# EasyEDA Pro project CH32V003_Programmer.eprj

# Schematic V1Schematic
Board Name: Board1; Create Date: 2025-06-25; Page Name: P1; Project Name: CH32V003 Programmer; Schematic Name: Schematic1; Update Date: 2025-08-17; Company: m039; Drawn: Dmitry Mozgin; Page Size: A4; Version: V1.0
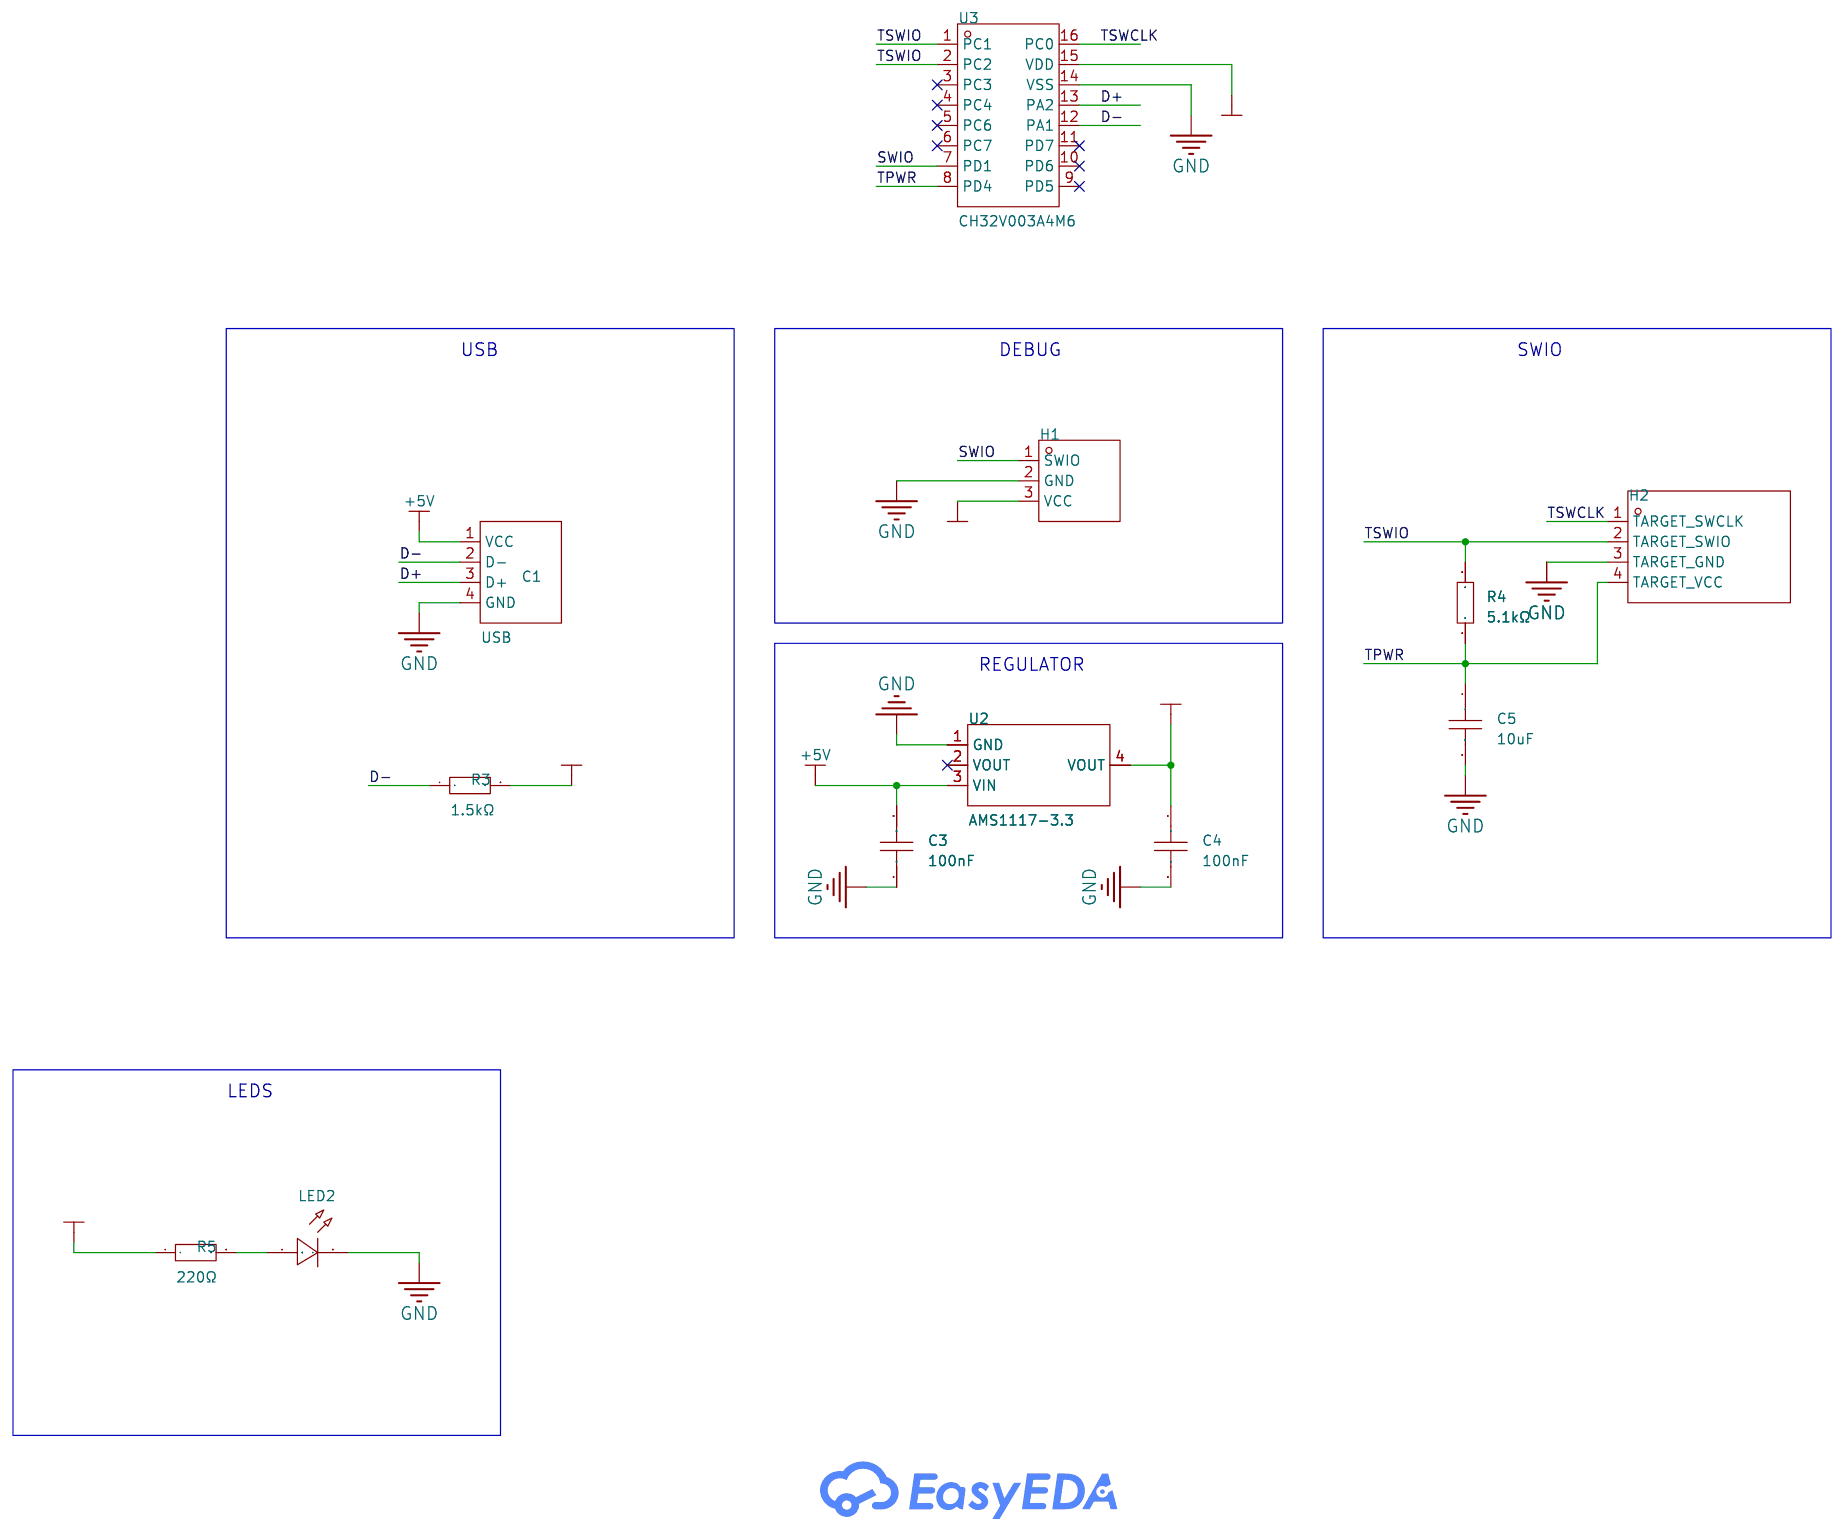
[diagram p0: schematic sheet]

## Parts
C1  USB  [USB Type-C 4P]
C3  100nF  [CAP-TH_L5.8-W3.0-P4.7-D0.45]
C4  100nF  [CAP-TH_L5.8-W3.0-P4.7-D0.45]
C5  10uF  [CAP-TH_L5.8-W3.0-P4.7-D0.45]
H1  -  [HDR-TH_3P-P2.54-V-M]
H2  -  [HDR-TH_4P-P2.54-V-M]
LED2  -  [LED-TH_BD3.0-P2.54-FD]
R3  1.5kΩ  [RES-TH_BD1.8-L3.2-P7.20-D0.4]
R4  5.1kΩ  [RES-TH_BD1.8-L3.2-P7.20-D0.4]
R5  220Ω  [RES-TH_BD1.8-L3.2-P7.20-D0.4]
U2  AMS1117-3.3  [SOT-223-3_L6.5-W3.4-P2.30-LS7.0-BR]
U3  CH32V003A4M6  [SOIC-16_L9.9-W3.9-P1.27-LS6.0-BL]

## Library data of the parts
C1 = USB Type-C 4P Board
C3-C5 = 1C10Z5U104M050B: LCSC Part Name: 100nF ±20% 50V; Supplier Part: C3009699; Manufacturer: VISHAY(威世); Supplier Footprint: 插件,P=10mm; JLCPCB Part Class: Extended Part; Datasheet: https://atta.szlcsc.com/upload/public/pdf/source/20210701/0CF1A7AD3406E72B391D35880AF61B15.pdf; Supplier: LCSC; Tolerance: ±20%; Voltage Rating: 50V; Pin Spacing: 2.54mm; Temperature Coefficient: Z5U; Diameter: 5.08mm; Body Thickness: 3.18mm
H1 = HDR-M_2.54_1x3P: Supplier Footprint: Through
H2 = HDR-M_2.54_1x4P: Supplier Footprint: Through
LED2 = LED_TH-R_3mm: Supplier Footprint: Through
R3-R5 = Res_AXIAL-1/8W: Supplier Footprint: Through
U2 = AMS1117-3.3_C6186: LCSC Part Name: 输出3.3V 1A; Supplier Part: C6186; Manufacturer: AMS; Supplier Footprint: SOT-223; JLCPCB Part Class: Basic Part; Datasheet: https://atta.szlcsc.com/upload/public/pdf/source/20180727/C6186_7A095716F0823C02F1997A905E26C086.pdf; Supplier: LCSC; Output Type: Fixed; Voltage - Supply: 16V; Output Voltage: 3.3V; Output Current: 1A; Power Supply Rejection Ratio (PSRR): 72dB@(120Hz); Voltage Dropout: 1.1V@(800mA); standby current: 5mA; Features: Over Current Protection；Over Temperature Protection; Operating Temperature: -40℃~+125℃; Output Configuration: Positive; Number of Outputs: 1
U3 = CH32V003A4M6: Supplier Part: C5346357; Manufacturer: WCH(南京沁恒); Supplier Footprint: SOP-16; JLCPCB Part Class: Extended Part; Datasheet: https://atta.szlcsc.com/upload/public/pdf/source/20250604/86DFE64B14CD7099775DB96D45CE90A6.pdf; Supplier: LCSC

## Nets
+3.3V: C4.1 H1.3(VCC) R3.2 R5.1 U2.4(VOUT) U3.15(VDD)
+5V: C1.1(VCC) C3.2 U2.3(VIN)
GND: C1.4(GND) C3.1 C4.2 C5.2 H1.2(GND) H2.3(TARGET_GND) LED2.2(A) U2.1(GND) U3.14(VSS)
D+: C1.3(D+) U3.13(PA2)
D-: C1.2(D-) R3.1 U3.12(PA1)
SWIO: H1.1(SWIO) U3.7(PD1)
TPWR: C5.1 H2.4(TARGET_VCC) R4.1 U3.8(PD4)
TSWCLK: H2.1(TARGET_SWCLK) U3.16(PC0)
TSWIO: H2.2(TARGET_SWIO) R4.2 U3.1(PC1) U3.2(PC2)
$1N3644: LED2.1(C) R5.2

Not connected (* = marked no-connect by the designer): U2 2(VOUT)*; U3 3(PC3)* 4(PC4)* 5(PC6)* 6(PC7)* 9(PD5)* 10(PD6)* 11(PD7)*

## Notes on the sheet
- USB
- DEBUG
- SWIO
- REGULATOR
- LEDS

# Schematic V2Schematic
Board Name: V2; Create Date: 2026-02-18; Page Name: P1; Project Name: CH32V003_Programmer; Schematic Name: V2Schematic; Update Date: 2026-02-19; Company: m039; Drawn: Dmitry Mozgin; Page Size: A4; Version: V1.0
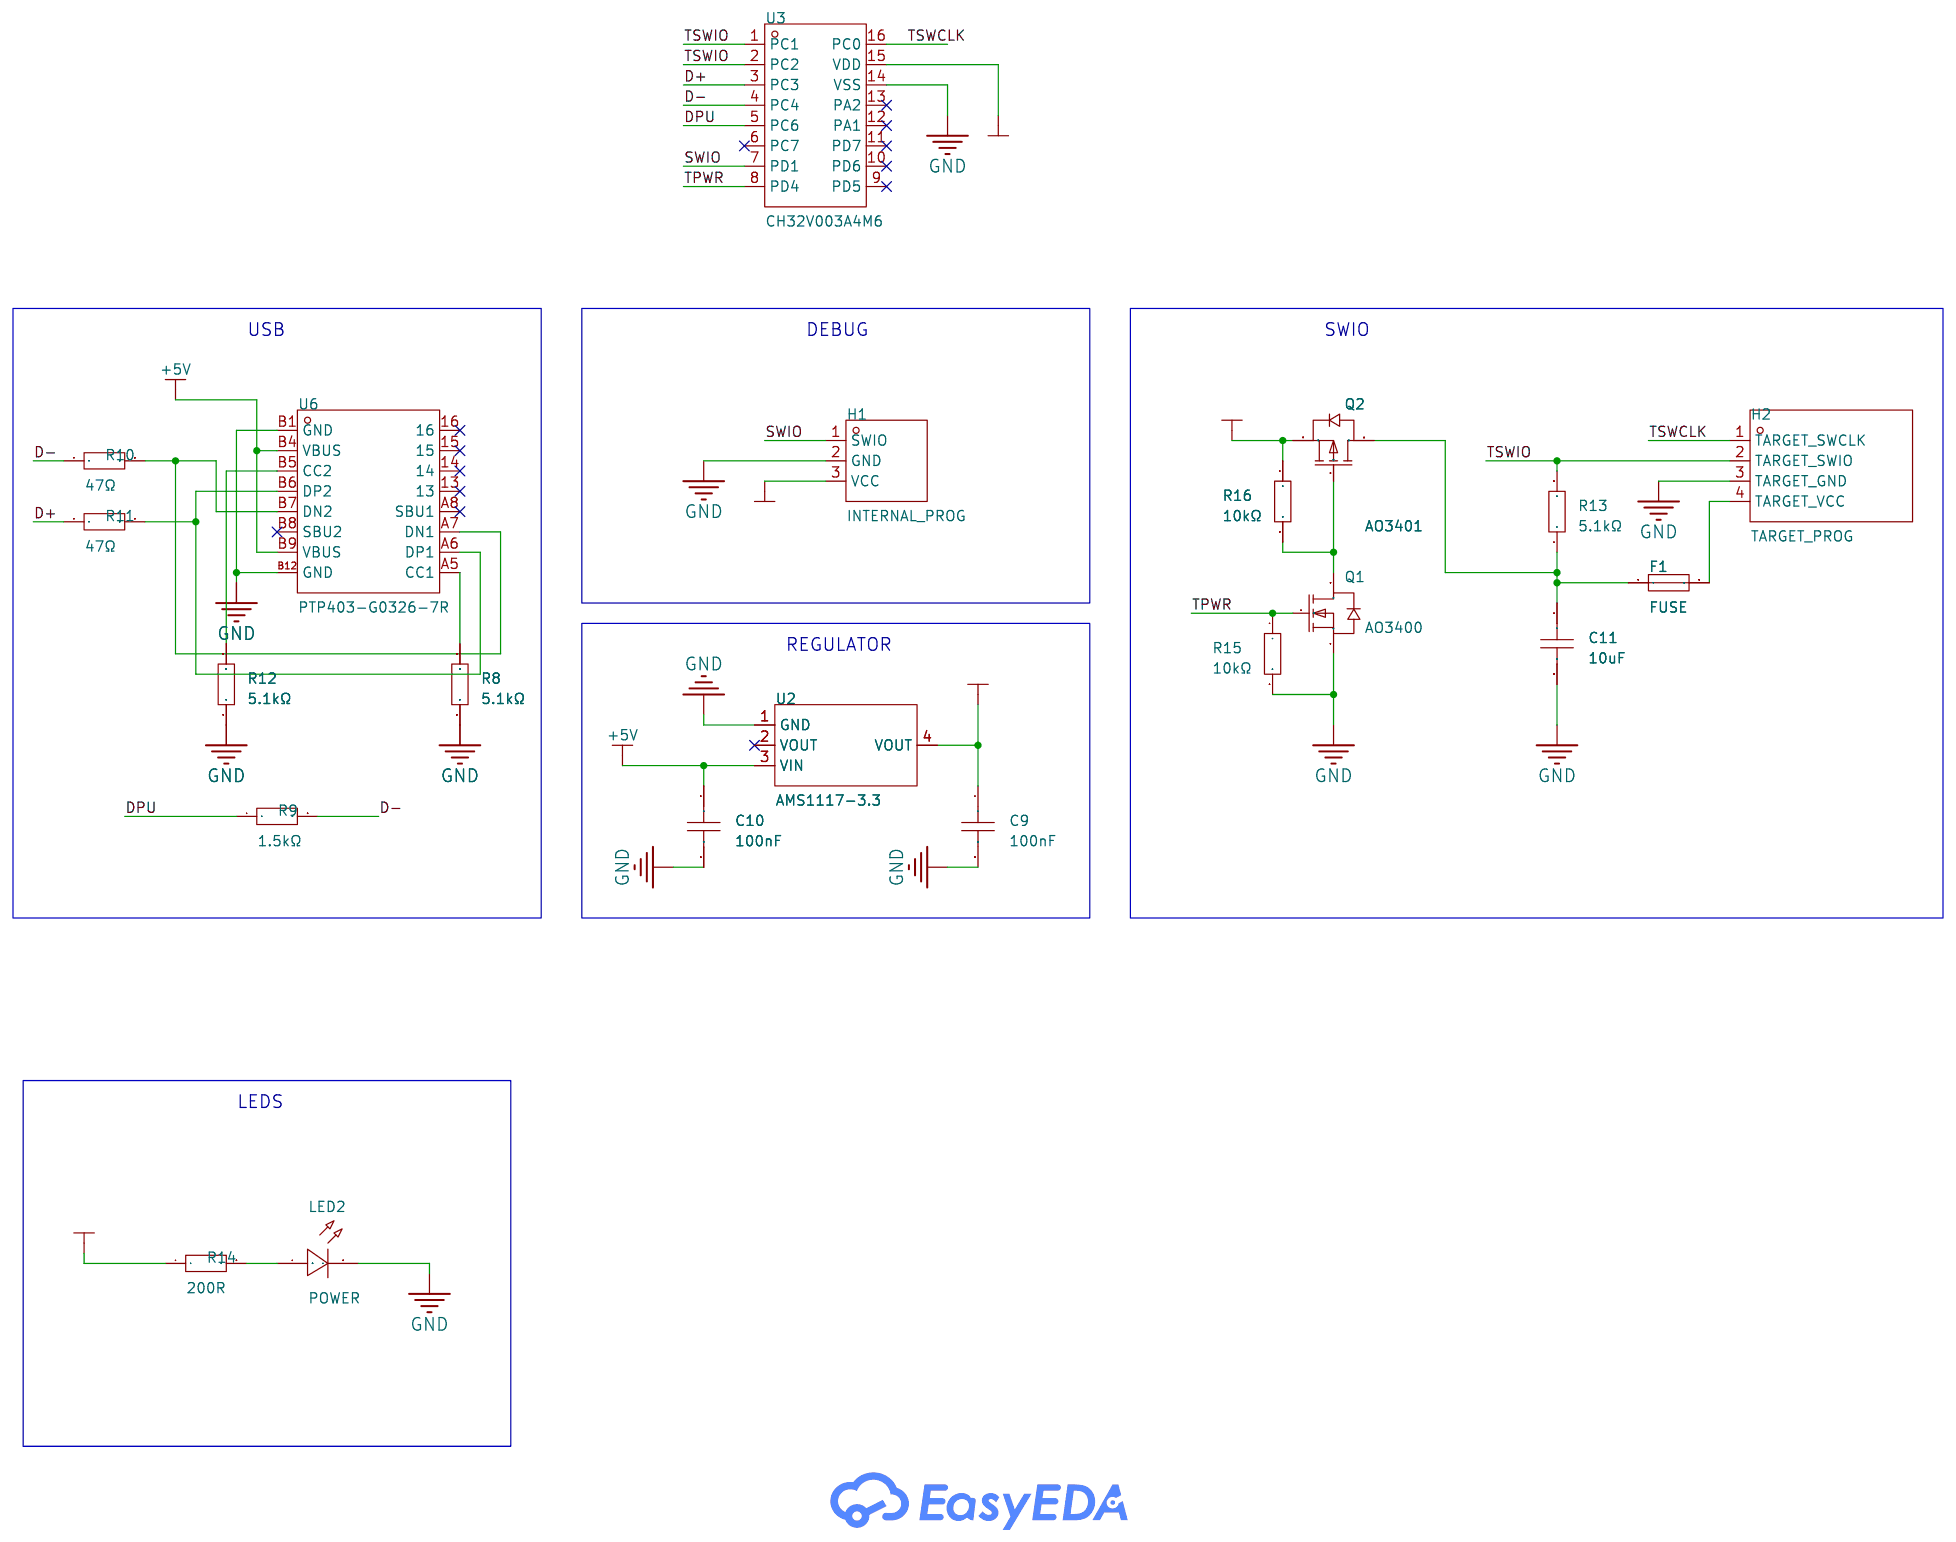
[diagram p1: schematic sheet]

## Parts
C9  100nF  [C0805]
C10  100nF  [C0805]
C11  10uF  [C0805]
F1  FUSE  [F0805]
H1  INTERNAL_PROG  [HDR-TH_3P-P2.54-V-M]
H2  TARGET_PROG  [HDR-TH_4P-P2.54-V-M]
LED2  POWER  [LED-TH_BD3.0-P2.54-FD]
Q1  AO3400  [SOT-23-3_L2.9-W1.6-P1.90-LS2.8-BR]
Q2  AO3401  [SOT-23-3_L2.9-W1.6-P1.90-LS2.8-BR]
R8  5.1kΩ  [R1206]
R9  1.5kΩ  [R1206]
R10  47Ω  [R1206]
R11  47Ω  [R1206]
R12  5.1kΩ  [R1206]
R13  5.1kΩ  [R1206]
R14  200R  [R1206]
R15  10kΩ  [R1206]
R16  10kΩ  [R1206]
U2  AMS1117-3.3  [SOT-223-3_L6.5-W3.4-P2.30-LS7.0-BR]
U3  CH32V003A4M6  [SOIC-16_L9.9-W3.9-P1.27-LS6.0-BL]
U6  PTP403-G0326-7R  [USB-SMD_PTP403-G0326-7R]

## Library data of the parts
C9-C11 = CAP_0805: Supplier Footprint: 0805
F1 = MFU0805FF00500P100: Supplier Part: C2649565; Manufacturer: VISHAY(威世); Supplier Footprint: 0805; JLCPCB Part Class: Extended Part; Datasheet: https://atta.szlcsc.com/upload/public/pdf/source/20210429/F397C0703A1059843D82BC00519F15A5.pdf; Supplier: LCSC; Current Rating: 500mA; Voltage Rating (DC): 32V; Operating Temperature: -55℃~+125℃; Interrupt Rating: 50A
H1 = HDR-M_2.54_1x3P: Supplier Footprint: Through
H2 = HDR-M_2.54_1x4P: Supplier Footprint: Through
LED2 = LED_TH-R_3mm: Supplier Footprint: Through
Q1 = AO3400_C20634976: LCSC Part Name: AO3400 5.8A N MOS大体积; Supplier Part: C20634976; Manufacturer: FOSAN(富捷/富信); Supplier Footprint: SOT-23-3L; JLCPCB Part Class: Extended Part; Datasheet: https://item.szlcsc.com/datasheet/AO3400/22049313.html; Supplier: LCSC; Number: One N-channel; Drain to Source Voltage: 30V; Current - Continuous Drain(Id): 5.8A; RDS(on): 25mΩ@4.5V; Pd - Power Dissipation: 1.3W; Gate Threshold Voltage (Vgs(th)): 900mV@250uA; Gate Charge(Qg): 22nC@15V; Input Capacitance(Ciss): 630pF; Reverse Transfer Capacitance (Crss@Vds): 71pF; Operating Temperature: -55℃~150℃; Type: N-Channel; Output Capacitance(Coss): 55pF
Q2 = AO3401_C20634975: LCSC Part Name: AO3401 4.4A  P MOS大体积; Supplier Part: C20634975; Manufacturer: FOSAN(富捷/富信); Supplier Footprint: SOT-23-3L; JLCPCB Part Class: Extended Part; Datasheet: https://item.szlcsc.com/datasheet/AO3401/22049302.html; Supplier: LCSC; Drain to Source Voltage: 30V; Current - Continuous Drain(Id): 4.4A; RDS(on): 96mΩ@2.5V; Pd - Power Dissipation: 1.2W; Gate Threshold Voltage (Vgs(th)): 1.4V@250uA; Gate Charge(Qg): 22nC@10V; Input Capacitance(Ciss): 1.04nF; Reverse Transfer Capacitance (Crss@Vds): 68pF; Type: P-Channel; Output Capacitance(Coss): 80pF
R8-R16 = Res_1206: Supplier Footprint: 1206
U2 = AMS1117-3.3_C6186: LCSC Part Name: 输出3.3V 1A; Supplier Part: C6186; Manufacturer: AMS; Supplier Footprint: SOT-223; JLCPCB Part Class: Basic Part; Datasheet: https://atta.szlcsc.com/upload/public/pdf/source/20180727/C6186_7A095716F0823C02F1997A905E26C086.pdf; Supplier: LCSC; Output Type: Fixed; Voltage - Supply: 16V; Output Voltage: 3.3V; Output Current: 1A; Power Supply Rejection Ratio (PSRR): 72dB@(120Hz); Voltage Dropout: 1.1V@(800mA); standby current: 5mA; Features: Over Current Protection；Over Temperature Protection; Operating Temperature: -40℃~+125℃; Output Configuration: Positive; Number of Outputs: 1
U3 = CH32V003A4M6: Supplier Part: C5346357; Manufacturer: WCH(南京沁恒); Supplier Footprint: SOP-16; JLCPCB Part Class: Extended Part; Datasheet: https://atta.szlcsc.com/upload/public/pdf/source/20250604/86DFE64B14CD7099775DB96D45CE90A6.pdf; Supplier: LCSC
U6 = USB Type-C 16P: Supplier Part: C9900000187; Supplier Footprint: USB3-TYPEC-16PIN-COM; JLCPCB Part Class: Extended Part; Supplier: LCSC

## Nets
+3.3V: C9.1 H1.3(VCC) Q2.2(S) R14.1 R16.1 U2.4(VOUT) U3.15(VDD)
+5V: C10.1 U2.3(VIN) U6.B4(VBUS) U6.B9(VBUS)
GND: C9.2 C10.2 C11.2 H1.2(GND) H2.3(TARGET_GND) LED2.2(A) Q1.2(S) R8.1 R12.1 R15.2 U2.1(GND) U3.14(VSS) U6.B1(GND) U6.B12(GND)
D+: R11.1 U3.3(PC3)
D-: R9.2 R10.1 U3.4(PC4)
DPU: R9.1 U3.5(PC6)
SWIO: H1.1(SWIO) U3.7(PD1)
TPWR: Q1.1(G) R15.1 U3.8(PD4)
TSWCLK: H2.1(TARGET_SWCLK) U3.16(PC0)
TSWIO: H2.2(TARGET_SWIO) R13.2 U3.1(PC1) U3.2(PC2)
$1N3644: LED2.1(C) R14.2
$1N6548: R11.2 U6.A6(DP1) U6.B6(DP2)
$1N6549: R10.2 U6.A7(DN1) U6.B7(DN2)
$1N6552: R12.2 U6.B5(CC2)
$1N6555: R8.2 U6.A5(CC1)
$1N7142: F1.2 H2.4(TARGET_VCC)
$1N7963: Q1.3(D) Q2.1(G) R16.2
$1N8029: C11.1 F1.1 Q2.3(D) R13.1

Not connected (* = marked no-connect by the designer): U2 2(VOUT)*; U3 6(PC7)* 9(PD5)* 10(PD6)* 11(PD7)* 12(PA1)* 13(PA2)*; U6 13* 14* 15* 16* A8(SBU1)* B8(SBU2)*

## Notes on the sheet
- USB
- DEBUG
- SWIO
- REGULATOR
- LEDS

# Board V1PCB
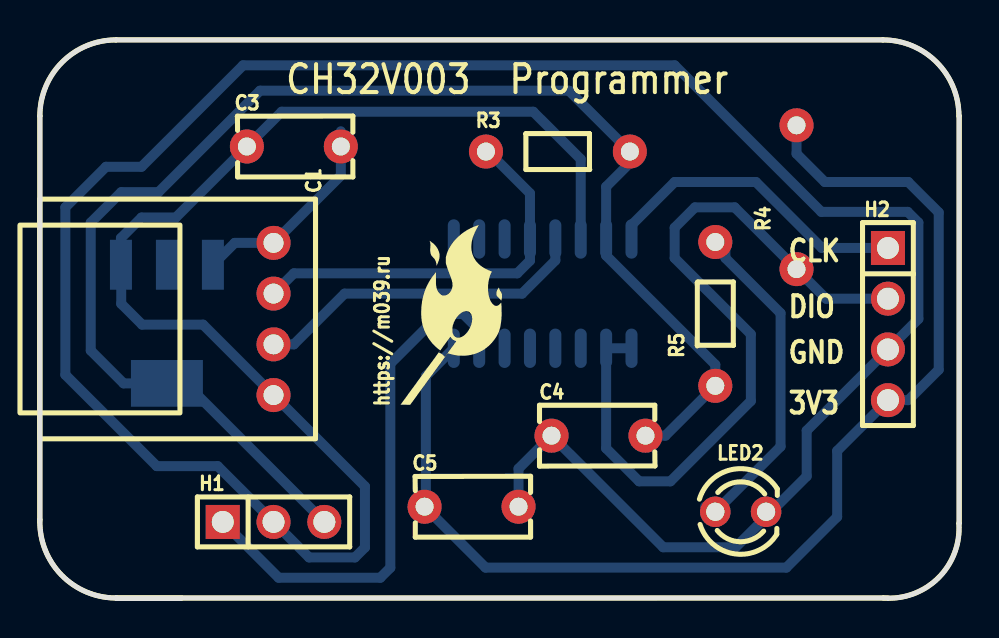
[diagram p2: board, top side]
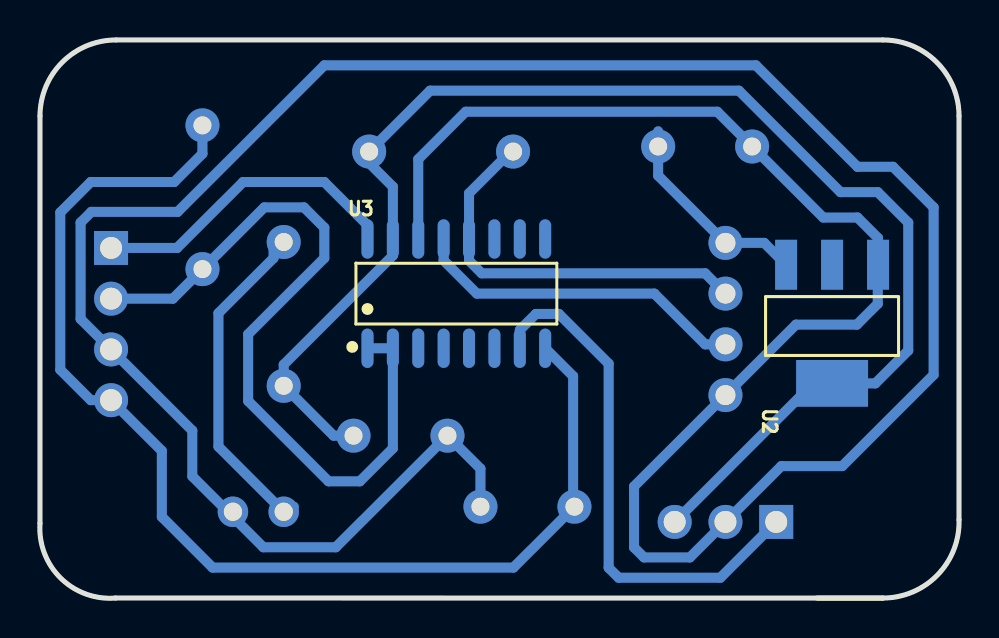
[diagram p3: board, bottom side, seen from below]

Outline 45.97 x 27.94 mm; copper layers: Top Layer, Bottom Layer. Coordinates in mm from the lower left corner of the outline.
Outline path: 3.81,0 arc(1.08,1.15) 0,3.92 0,24.13 arc(1.12,26.83) 3.81,27.94 42.16,27.94 arc(44.86,26.82) 45.97,24.13 45.97,3.74 arc(44.94,1) 42.19,0 3.81,0 ; 3.81,0 7.11,0
Stack: Top Layer 0.035mm / Dielectric1 1.51mm FR4 er 4.5 / Bottom Layer 0.035mm

## Design rules (mm)
template: Custom Config
spacing copperThickness1oz (default): track to track 0.3, other pairs 0.152 to 0.3
spacing copperThickness2oz: track to track 0.203, other pairs 0.152 to 0.3
track width copperThickness1oz (default): min 0.127, default 0.5, max 2.54
track width copperThickness2oz: min 0.203, default 0.254, max 2.54
differential pair differentialPair (default): width min 0.127, default 0.254, max 2.54; gap min 0.152, default 0.152
via viaSize (default): diameter min 0.5, default 0.61, max 10; hole min 0.3, default 0.305, max 6.3

## Placement (name value [footprint] x y rotation side)
C1  USB  [USB Type-C 4P]  11.68 13.97 270 top
C3  100nF  [CAP-TH_L5.8-W3.0-P4.7-D0.45]  12.7 22.61 0 top
C4  100nF  [CAP-TH_L5.8-W3.0-P4.7-D0.45]  27.94 8.13 180 top
C5  10uF  [CAP-TH_L5.8-W3.0-P4.7-D0.45]  21.59 4.57 0 top
H1  -  [HDR-TH_3P-P2.54-V-M]  11.68 3.81 0 top
H2  -  [HDR-TH_4P-P2.54-V-M]  42.42 13.72 270 top
LED2  -  [LED-TH_BD3.0-P2.54-FD]  35.05 4.32 0 top
R3  1.5kΩ  [RES-TH_BD1.8-L3.2-P7.20-D0.4]  25.91 22.35 0 top
R4  5.1kΩ  [RES-TH_BD1.8-L3.2-P7.20-D0.4]  37.85 20.07 270 top
R5  220Ω  [RES-TH_BD1.8-L3.2-P7.20-D0.4]  33.78 14.23 90 top
U2  AMS1117-3.3  [SOT-223-3_L6.5-W3.4-P2.30-LS7.0-BR]  6.35 13.72 90 bottom
U3  CH32V003A4M6  [SOIC-16_L9.9-W3.9-P1.27-LS6.0-BL]  25.15 15.24 180 bottom

## Footprints (pads in the part's own frame, mm; a bottom-side part is the same pattern mirrored in y, then rotated)
CAP-TH_L5.8-W3.0-P4.7-D0.45
  round 1.7 hole 0.9: 1(-2.35,0) 2(2.35,0)
HDR-TH_3P-P2.54-V-M
  rect 1.7x1.7 hole 1.1x0.9: 1(-2.54,0)
  round 1.7 hole 1.1x0.9: 2(0,0) 3(2.54,0)
HDR-TH_4P-P2.54-V-M
  rect 1.7x1.7 hole 1.1x0.9: 1(-3.81,0)
  round 1.7 hole 1.1x0.9: 2(-1.27,0) 3(1.27,0) 4(3.81,0)
LED-TH_BD3.0-P2.54-FD
  round 1.524 hole 0.914x0.9: 1(-1.27,0) 2(1.27,0)
RES-TH_BD1.8-L3.2-P7.20-D0.4
  round 1.7 hole 0.9: 1(-3.6,0) 2(3.6,0)
SOIC-16_L9.9-W3.9-P1.27-LS6.0-BL
  oval 0.602x1.971 smd: 1(-4.445,-2.736) 2(-3.175,-2.736) 3(-1.905,-2.736) 4(-0.635,-2.736) 5(0.635,-2.736) 6(1.905,-2.736) 7(3.175,-2.736) 8(4.445,-2.736) 9(4.445,2.736) 10(3.175,2.736) 11(1.905,2.736) 12(0.635,2.736) 13(-0.635,2.736) 14(-1.905,2.736) 15(-3.175,2.736) 16(-4.445,2.736)
SOT-223-3_L6.5-W3.4-P2.30-LS7.0-BR
  rect 2.5x1.1 smd: 1(2.97,-2.3) 2(2.97,0) 3(2.97,2.3)
  rect 2.34x3.6 smd: 4(-2.97,0)
USB Type-C 4P
  round 1.7 hole 1x0.9: 1(-3.81,0) 2(-1.27,0) 3(1.27,0) 4(3.81,0)

## Nets
As in the schematic.

Pads without a net: U2 2; U3 3 4 5 6 9 10 11

## Routing (per net, layer and track width the routed paths; a pad name or vN(x,y) marks a point on that pad's centre or on a via; arc(x,y) is an arc through that point)
+3.3V: length 71.6
  Bottom Layer w0.5: H1.3 7.29,10.75 U2.4 4.19,10.75 2.54,12.39 2.54,18.8 4.06,20.32 5.93,20.32 11.01,25.4 26.46,25.4 R3.2 29.51,21.78 28.32,20.59 U3.15 28.32,17.15 33.78,11.69 R5.1 31.29,8.13 C4.1
+5V: length 10.5
  Bottom Layer w0.5: U2.3 9.74,17.78 C1.1 15.05,21.15 15.05,23.37
GND: length 164.3
  Bottom Layer w0.5: U3.14 27.05,21.97 24.68,24.35 12.09,24.35 C3.1 6.79,19.05 5.08,19.05 4.05,18.02 U2.1 4.06,16.67 4.06,14.73 5.11,13.69 8.16,13.69 C1.4 16.26,5.59 16.26,2.53 15.76,2.03 13.46,2.03 H1.2 8.89,6.61 5.84,6.61 1.27,11.18 1.27,19.56 3.3,21.59 5.08,21.59 10.16,26.67 31.75,26.67 39.09,19.33 43.41,19.33 43.94,18.8 43.94,13.97 H2.3 38.35,8.38 38.35,6.1 34.8,2.54 31.18,2.54 26.1,7.62 ; C4.2 23.94,6.48 C5.2
D+: length 16.9
  Bottom Layer w0.5: C1.3 12.7,12.7 15.24,15.24 24.12,15.24 25.78,16.9 U3.13
D-: length 20
  Bottom Layer w0.5: R3.1 22.42,22.35 24.51,20.26 U3.12 24.51,16.89 23.88,16.26 12.7,16.26 C1.2
SWIO: length 26.7
  Bottom Layer w0.5: H1.1 11.94,1.02 17.03,1.02 17.53,1.52 17.53,11.73 20.02,14.23 21.16,14.23 21.97,13.42 21.97,12.51
TPWR: length 59.2
  Bottom Layer w0.5: U3.8 19.3,11.11 19.3,4.64 C5.1 22.29,1.53 37.34,1.53 39.88,4.07 39.88,7.37 H2.4 43.43,9.91 44.96,11.43 44.96,19.31 43.43,20.83 39.26,20.83 37.85,22.25 R4.1
TSWCLK: length 15.8
  Bottom Layer w0.5: H2.1 39.12,17.53 35.81,20.83 31.75,20.83 29.59,18.67 29.59,17.98
TSWIO: length 39.1
  Bottom Layer w0.5: 29.59,12.51 U3.2 28.32,7.49 29.97,5.84 31.54,5.84 35.56,9.87 35.56,13.21 31.75,17.02 31.75,18.54 32.77,19.56 34.75,19.56 R4.2 39.33,14.99 H2.2
$1N3644: length 16.1
  Bottom Layer w0.5: LED2.1 37.05,7.58 37.05,14.26 34.29,17.02 34.29,17.83 ; 33.27,4.57 33.41,4.57

## Text on the board
Top Silkscreen Layer: https://m039.ru | CLK | DIO | GND | 3V3 | CH32V003 | Programmer

# Board PCB5
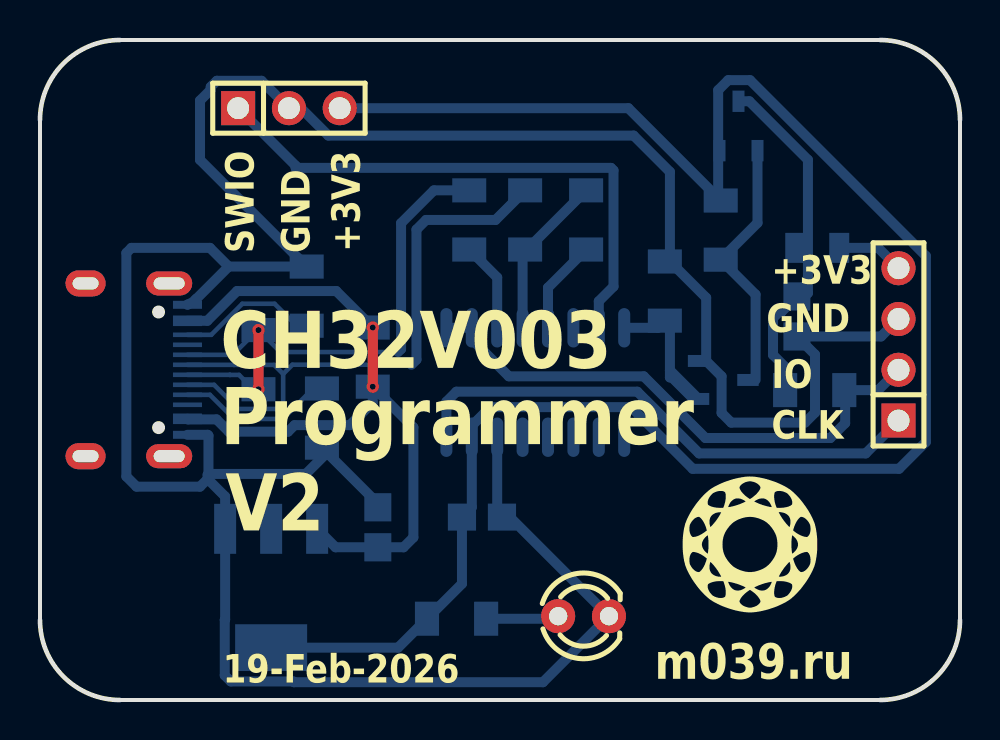
[diagram p4: board, top side]
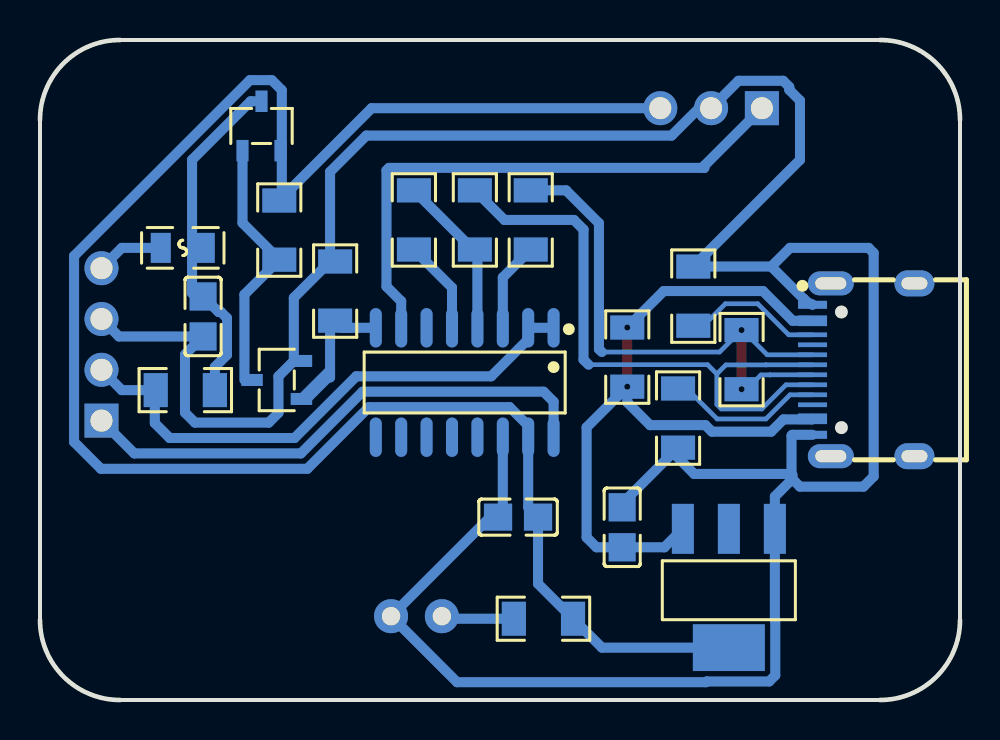
[diagram p5: board, bottom side, seen from below]

Outline 46 x 33 mm; copper layers: Top Layer, Bottom Layer. Coordinates in mm from the lower left corner of the outline.
Outline path: 0,29 0,4 arc(1.17,1.17) 4,0 42,0 arc(44.83,1.17) 46,4 46,29 arc(44.83,31.83) 42,33 4,33 arc(1.17,31.83) 0,29
Stack: Top Layer 0.035mm / Dielectric1 1.51mm FR4 er 4.5 / Bottom Layer 0.035mm

## Design rules (mm)
template: Custom Config
spacing copperThickness1oz (default): track to track 0.27, other pairs 0.152 to 0.3
spacing copperThickness2oz: track to track 0.203, other pairs 0.152 to 0.3
track width copperThickness1oz (default): min 0.127, default 0.5, max 2.54
track width copperThickness2oz: min 0.203, default 0.254, max 2.54
differential pair differentialPair (default): width min 0.127, default 0.254, max 2.54; gap min 0.152, default 0.152
via viaSize (default): diameter min 0.5, default 0.61, max 10; hole min 0.3, default 0.305, max 6.3

## Placement (name value [footprint] x y rotation side)
C9  100nF  [C0805]  22.1 9.14 0 bottom
C10  100nF  [C0805]  16.89 8.64 90 bottom
C11  10uF  [C0805]  37.85 19.18 270 bottom
F1  FUSE  [F0805]  38.86 22.61 0 bottom
H1  INTERNAL_PROG  [HDR-TH_3P-P2.54-V-M]  12.45 29.59 0 top
H2  TARGET_PROG  [HDR-TH_4P-P2.54-V-M]  42.93 17.78 90 top
LED2  POWER  [LED-TH_BD3.0-P2.54-FD]  27.18 4.19 0 top
Q1  AO3400  [SOT-23-3_L2.9-W1.6-P1.90-LS2.8-BR]  34.16 16 180 bottom
Q2  AO3401  [SOT-23-3_L2.9-W1.6-P1.90-LS2.8-BR]  34.93 28.7 270 bottom
R8  5.1kΩ  [R1206]  14.1 14.1 90 bottom
R9  1.5kΩ  [R1206]  27.31 24 90 bottom
R10  47Ω  [R1206]  24.26 24 90 bottom
R11  47Ω  [R1206]  21.46 24 90 bottom
R12  5.1kΩ  [R1206]  13.34 20.19 270 bottom
R13  5.1kΩ  [R1206]  38.74 15.49 0 bottom
R14  200R  [R1206]  20.83 4.06 0 bottom
R15  10kΩ  [R1206]  31.24 20.45 90 bottom
R16  10kΩ  [R1206]  34.04 23.5 270 bottom
R17  -  [R1206]  10.92 17.02 270 bottom
R17#2  -  [R1206]  16.64 17.14 270 bottom
U2  AMS1117-3.3  [SOT-223-3_L6.5-W3.4-P2.30-LS7.0-BR]  11.56 5.59 90 bottom
U3  CH32V003A4M6  [SOIC-16_L9.9-W3.9-P1.27-LS6.0-BL]  24.76 15.88 0 bottom
U6  PTP403-G0326-7R  [USB-SMD_PTP403-G0326-7R]  4.83 16.51 90 bottom

## Footprints (pads in the part's own frame, mm; a bottom-side part is the same pattern mirrored in y, then rotated)
C0805
  rect 1.41x1.35 smd: 1(-1,0) 2(1,0)
F0805
  rect 1x1.5 smd: 1(-1.1,0) 2(1.1,0)
HDR-TH_3P-P2.54-V-M
  rect 1.7x1.7 hole 1.1x0.9: 1(-2.54,0)
  round 1.7 hole 1.1x0.9: 2(0,0) 3(2.54,0)
HDR-TH_4P-P2.54-V-M
  rect 1.7x1.7 hole 1.1x0.9: 1(-3.81,0)
  round 1.7 hole 1.1x0.9: 2(-1.27,0) 3(1.27,0) 4(3.81,0)
LED-TH_BD3.0-P2.54-FD
  round 1.7 hole 0.914x0.9: 1(-1.27,0) 2(1.27,0)
R1206
  rect 1.208x1.701 smd: 1(-1.479,0) 2(1.479,0)
SOIC-16_L9.9-W3.9-P1.27-LS6.0-BL
  oval 0.602x1.971 smd: 1(-4.445,-2.736) 2(-3.175,-2.736) 3(-1.905,-2.736) 4(-0.635,-2.736) 5(0.635,-2.736) 6(1.905,-2.736) 7(3.175,-2.736) 8(4.445,-2.736) 9(4.445,2.736) 10(3.175,2.736) 11(1.905,2.736) 12(0.635,2.736) 13(-0.635,2.736) 14(-1.905,2.736) 15(-3.175,2.736) 16(-4.445,2.736)
SOT-23-3_L2.9-W1.6-P1.90-LS2.8-BR
  rect 1.07x0.6 smd: 1(1.235,-0.95) 2(1.235,0.95) 3(-1.235,0)
SOT-223-3_L6.5-W3.4-P2.30-LS7.0-BR
  rect 2.5x1.1 smd: 1(2.97,-2.3) 2(2.97,0) 3(2.97,2.3)
  rect 2.34x3.6 smd: 4(-2.97,0)
USB-SMD_PTP403-G0326-7R
  oval 1.2x2.3 hole 0.6x1.55: 13(-4.32,1.633) 14(4.32,1.633)
  oval 1.3x2 hole 0.6x1.3: 15(-4.32,-2.547) 16(4.32,-2.547)
  rect 0.23x1.45 smd: A5(-1.25,2.547) A6(-0.25,2.547) A7(0.25,2.547) A8(1.25,2.547) B5(1.75,2.547) B6(0.75,2.547) B7(-0.75,2.547) B8(-1.75,2.547)
  rect 0.4x1.45 smd: B1(3.25,2.547) B12(-3.25,2.547)
  rect 0.53x1.45 smd: B4(2.45,2.547) B9(-2.45,2.547)

## Nets
As in the schematic, except:
+5V: C10.1 R17#2.1 R17#2.2 U2.3 U6.B4 U6.B9
$1N6548: R11.2 R17.1 R17.2 U6.A6 U6.B6

Pads without a net: U2 2; U3 6 9 10 11 12 13; U6 13 14 15 16 A8 B8

## Via types
v1: diameter 0.61, hole 0.305, Top Layer to Bottom Layer, 4 vias

## Routing (per net, layer and track width the routed paths; a pad name or vN(x,y) marks a point on that pad's centre or on a via; arc(x,y) is an arc through that point)
+3.3V: length 93.7
  Bottom Layer w0.5: U2.4 17.9,2.62 R14.1 21.1,5.81 C9.1 21.59,9.64 U3.15 21.59,13.72 22.52,14.64 29.55,14.64 32.64,11.56 42.95,11.56 44.3,12.9 44.3,22.2 35.5,30.99 34.41,30.99 33.91,30.49 33.91,25.36 33.78,25.23 ; 33.78,25.23 R16.1 ; 33.78,25.23 29.42,29.59 H1.3
+5V: length 38.3
  Top Layer w0.5: v1(16.64,18.62) v1(16.64,15.67)
  Bottom Layer w0.5: v1(16.64,18.62) 14.81,20.45 9.85,20.45 8.37,18.96 U6.B4 ; U2.3 14.78,7.64 C10.1 18.18,7.64 18.67,8.13 18.67,13.63 v1(16.64,15.67) 16.64,14.89 15.49,13.74 12.73,13.74 12.4,13.42 9.44,13.42 8.83,14.03 7.4,14.03 U6.B9
GND: length 148.4
  Bottom Layer w0.5: 14.35,12.36 16.89,9.82 C10.2 ; 14.35,12.36 R8.1 ; 14.35,12.36 13.29,11.3 8.42,11.3 ; U6.B1 7.39,19.78 arc(7.59,19.88) 7.77,20.01 ; 9.43,21.67 8.5,22.61 4.57,22.61 4.32,22.35 4.32,11.18 4.83,10.67 8,10.67 8.38,11.05 ; 9.43,21.67 R12.1 8,27.01 8,29.97 8.54,30.51 8.54,30.66 8.84,30.96 11.08,30.96 H1.2 13.05,29.59 14.42,28.22 29.68,28.22 31.5,26.41 31.5,21.93 33.31,20.11 33.31,16.95 34.08,16.18 34.08,14.35 34.56,13.87 38.25,13.87 38.75,14.37 38.75,17.27 C11.2 42.05,18.18 H2.3 ; 9.43,21.67 7.83,20.07 ; 8.42,11.3 8.42,13.22 8.38,13.26 U6.B12 ; 8.42,11.3 8.38,11.26 8.38,11.05 ; U3.14 22.86,9.38 C9.2 23.5,9.14 LED2.2 25.15,0.89 12.7,0.89 12.66,0.93 9.54,0.93 9.24,1.23 9.24,4 9.26,4.02 U2.1 9.26,10.17 8.38,11.05 ; 7.77,20.01 7.83,20.07 ; 7.77,20.01 arc(7.8,20.04) 7.83,20.07
D+: length 4.5
  Bottom Layer w0.5: U3.3 22.86,21.13 R11.1
D-: length 8.2
  Bottom Layer w0.5: U3.4 24.13,22.4 R10.1 24.35,22.52 R9.2
DPU: length 4.7
  Bottom Layer w0.5: U3.5 25.4,20.62 R9.1
SWIO: length 28.3
  Bottom Layer w0.5: H1.1 12.78,26.71 12.78,26.61 28.55,26.61 28.68,26.48 28.68,20.67 27.94,19.94 U3.7
TPWR: length 8.2
  Bottom Layer w0.5: Q1.1 31.5,16.48 ; 31.5,16.48 31.5,16.13 31.6,16.13 32.67,15.05 ; 31.5,16.48 31.5,18.46 ; U3.8 30.88,18.61 R15.1
TSWCLK: length 26.5
  Bottom Layer w0.5: U3.16 20.32,14.92 20.82,15.42 29.87,15.42 32.96,12.33 41.28,12.33 H2.1
TSWIO: length 27.4
  Bottom Layer w0.5: H2.2 41.91,15.49 R13.2 40.26,15.45 40.26,13.84 39.51,13.1 33.27,13.1 30.19,16.19 23.44,16.19 21.59,18.03 U3.2 ; 21.34,18.61 U3.1
$1N3644: length 3.7
  Bottom Layer w0.5: R14.2 25.78,4.06 LED2.1
$1N6548: length 29
  Top Layer w0.5: v1(10.92,18.5) v1(10.92,15.54)
  Bottom Layer w0.23: 17.91,17.4 12.02,17.4 v1(10.92,18.5) 10.88,18.5 9.64,17.26 U6.B6 ; 10.92,15.28 9.95,16.25 9.5,16.25 9.49,16.26 U6.A6
  Bottom Layer w0.5: R11.2 19.69,25.48 18.05,23.84 18.05,17.55 17.91,17.4
$1N6549: length 31.6
  Bottom Layer w0.23: 12.16,16.3 11.71,16.75 9.71,16.75 9.7,16.76 U6.A7 ; 12.16,16.3 12.62,16.76 18.57,16.76 ; 12.16,16.3 12.16,14.78 11.93,14.55 9.91,14.55 8.7,15.76 U6.B7
  Bottom Layer w0.5: R10.2 22.78,24 19.3,24 18.82,23.52 18.82,17.02 18.57,16.76
$1N6552: length 6.6
  Bottom Layer w0.23: U6.B5 8.56,18.26 10.12,19.81 11.73,19.81 12.83,18.71
$1N6555: length 8.4
  Bottom Layer w0.23: U6.A5 8.5,15.26 9.71,14.05 12.14,14.05 13.35,15.26 14.29,15.26 14.6,15.58
$1N7142: length 3.4
  Bottom Layer w0.5: H2.4 41.91,22.61 F1.2
$1N7963: length 12.9
  Bottom Layer w0.5: Q2.1 35.88,23.86 R16.2 35.78,20.27 35.78,16
$1N8029: length 17.1
  Bottom Layer w0.5: C11.1 37.07,19.4 36.96,19.4 36.65,19.1 36.65,17.26 37.26,16.65 R13.1 ; Q2.3 35.47,29.94 38.4,27.01 38.4,20.35 38.23,20.18

## Text on the board
Top Silkscreen Layer: SWIO | GND | +3V3 | 19-Feb-2026 | IO | CLK | m039.ru | CH32V003 | Programmer | V2
